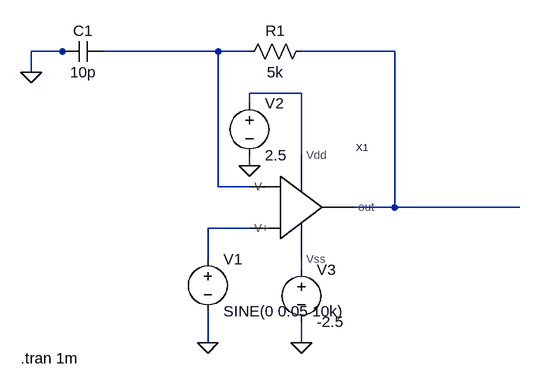
[diagram p0: schematic Draft21.asc]
Draft21.asc, the LTspice schematic file:
Version 4
SHEET 1 880 680
WIRE -192 -160 -240 -160
WIRE -176 -160 -192 -160
WIRE 48 -160 -128 -160
WIRE 96 -160 48 -160
WIRE 320 -160 176 -160
WIRE -240 -128 -240 -160
WIRE 176 -96 96 -96
WIRE 96 -80 96 -96
WIRE 176 0 176 -96
WIRE 96 16 96 0
WIRE 48 48 48 -160
WIRE 96 48 48 48
WIRE 320 80 320 -160
WIRE 320 80 256 80
WIRE 512 80 320 80
WIRE 96 112 32 112
WIRE 32 160 32 112
WIRE 176 176 176 160
WIRE 32 288 32 240
WIRE 176 288 176 256
FLAG 32 288 0
FLAG 176 288 0
FLAG 96 16 0
FLAG -240 -128 0
SYMBOL res 192 -176 R90
WINDOW 0 0 56 VBottom 2
WINDOW 3 32 56 VTop 2
SYMATTR InstName R1
SYMATTR Value 5k
SYMBOL voltage 32 144 R0
WINDOW 123 0 0 Left 0
WINDOW 39 0 0 Left 0
SYMATTR InstName V1
SYMATTR Value SINE(0 0.05 10k)
SYMBOL voltage 96 -96 R0
WINDOW 123 0 0 Left 0
WINDOW 39 0 0 Left 0
SYMATTR InstName V2
SYMATTR Value 2.5
SYMBOL voltage 176 160 R0
WINDOW 123 0 0 Left 0
WINDOW 39 0 0 Left 0
SYMATTR InstName V3
SYMATTR Value -2.5
SYMBOL OPAMP 64 80 R0
SYMATTR InstName X1
SYMBOL cap -128 -176 R90
WINDOW 0 0 32 VBottom 2
WINDOW 3 32 32 VTop 2
SYMATTR InstName C1
SYMATTR Value 10p
TEXT -256 312 Left 2 !.tran 1m

The netlist it stands for:
* Draft21.asc
R1 N002 N001 5k
V1 N004 0 SINE(0 0.05 10k)
V2 N003 0 2.5
V3 N005 0 -2.5
XX1 N003 N005 N001 N004 N002 OPAMP  ; pins Vdd Vss V- V+ out
C1 N001 0 10p
.tran 1m
.backanno
.end